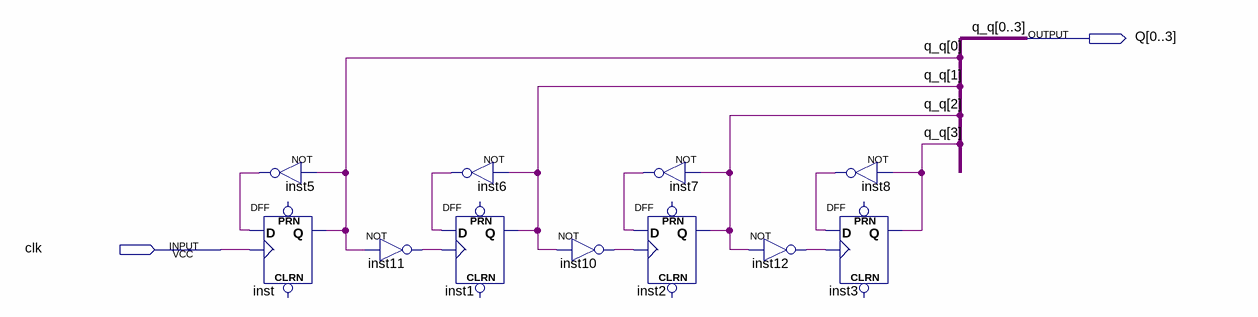
[diagram p0: schematic sheet]
// Quartus schematic async_counter_DTrigger.bdf as structural Verilog: 11 symbols, 2 pins
module async_counter_DTrigger (
  input  clk,
  output [0:3] Q
);

  wire inst5_out, inst6_out, inst7_out, inst8_out, inst10_out, inst11_out, inst12_out;

  not inst5 (inst5_out, Q[0]);
  DFF inst (.CLK(clk), .D(inst5_out), .Q(Q[0]));  // open: CLRN, PRN
  not inst11 (inst11_out, Q[0]);
  DFF inst1 (.CLK(inst11_out), .D(inst6_out), .Q(Q[1]));  // open: CLRN, PRN
  not inst6 (inst6_out, Q[1]);
  not inst10 (inst10_out, Q[1]);
  not inst7 (inst7_out, Q[2]);
  DFF inst2 (.CLK(inst10_out), .D(inst7_out), .Q(Q[2]));  // open: CLRN, PRN
  not inst12 (inst12_out, Q[2]);
  DFF inst3 (.CLK(inst12_out), .D(inst8_out), .Q(Q[3]));  // open: CLRN, PRN
  not inst8 (inst8_out, Q[3]);

  // Other names for the same wires on the sheet: q_q[3:0] = {Q[3], Q[2], Q[1], Q[0]}
endmodule
